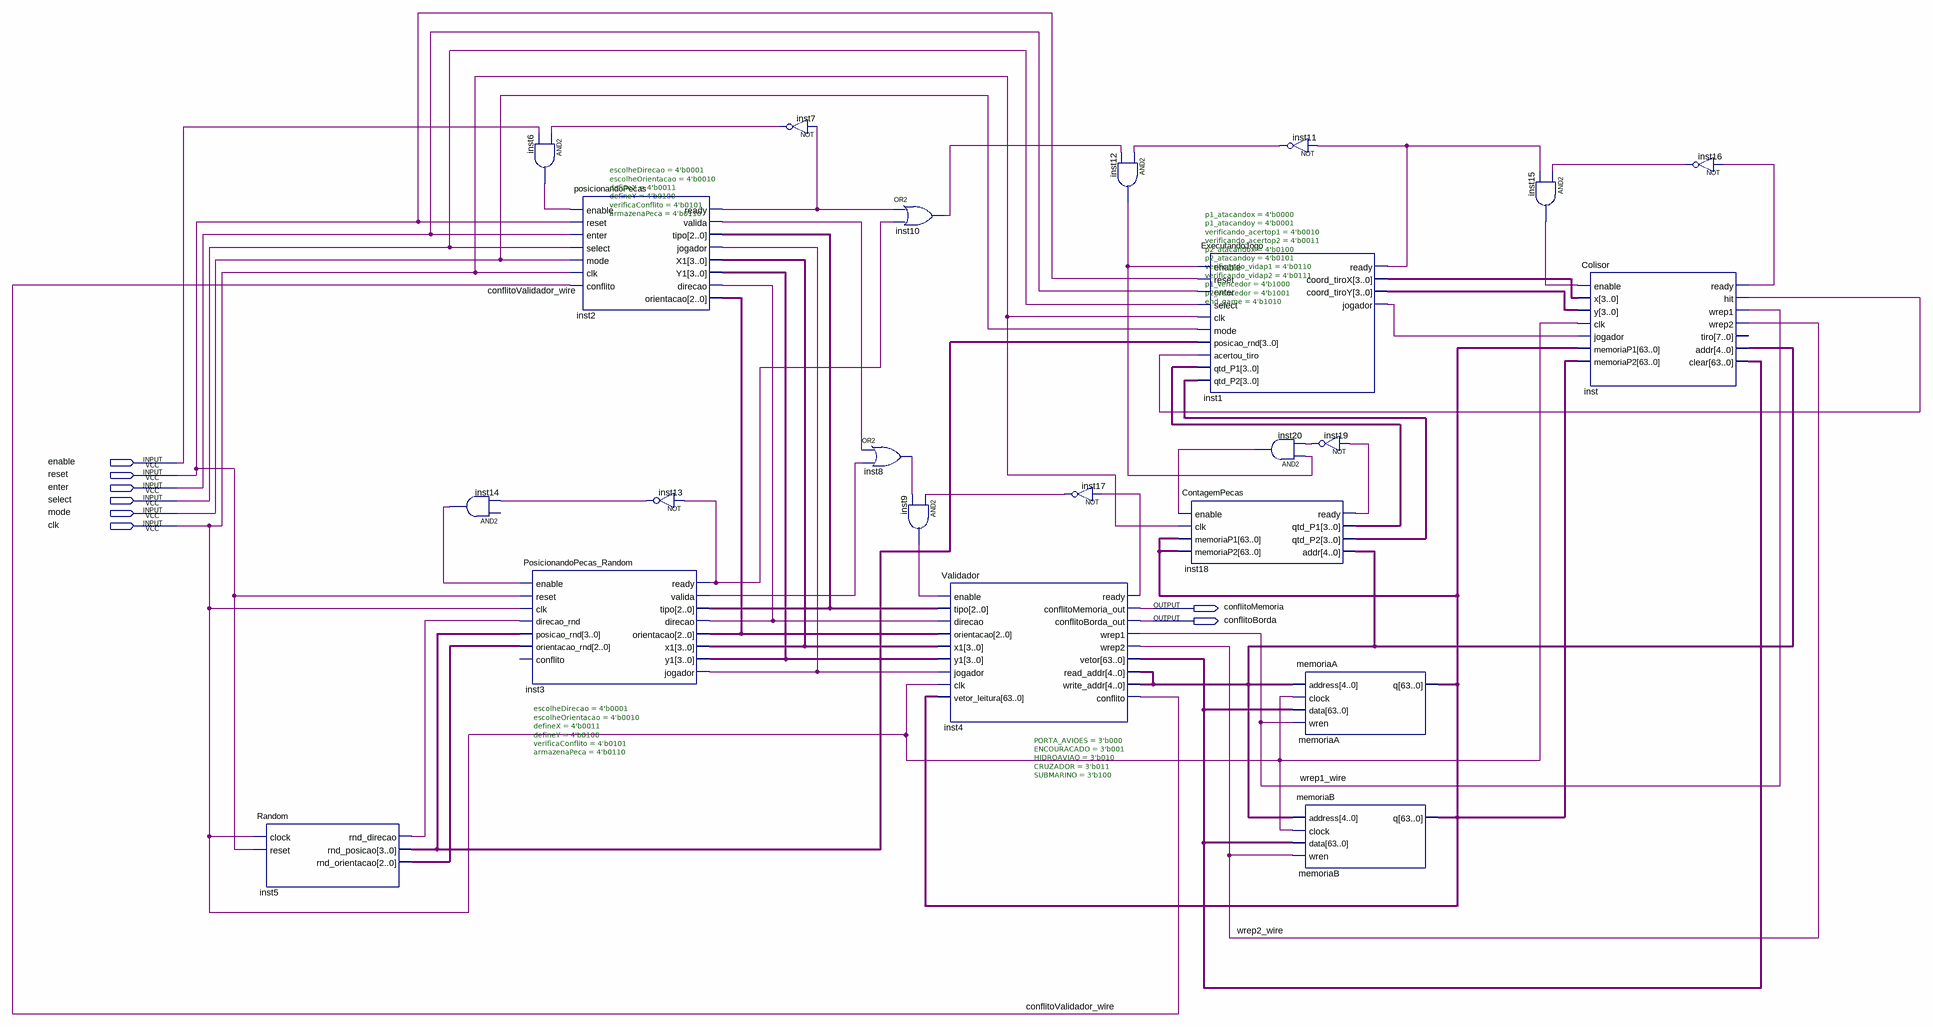
[diagram p0: schematic sheet]
// Quartus schematic BatalhaNavalDefinitivo.bdf as structural Verilog: 23 symbols, 8 pins
module BatalhaNavalDefinitivo (
  input  enable,
  input  reset,
  input  enter,
  input  select,
  input  mode,
  input  clk,
  output conflitoMemoria,
  output conflitoBorda
);

  wire conflitoValidador_wire, inst1_jogador, inst1_ready, inst2_ready, inst2_valida, inst3_direcao,
       inst3_jogador, inst3_ready, inst3_valida, inst4_ready, inst5_rnd_direcao, inst6_out, inst7_out,
       inst8_out, inst9_out, inst10_out, inst11_out, inst12_out, inst13_out, inst14_out, inst15_out,
       inst16_out, inst17_out, inst18_ready, inst19_out, inst20_out, inst_hit, inst_ready, wrep1_wire,
       wrep2_wire;
  wire [2:0] inst3_orientacao, inst3_tipo, inst5_rnd_orientacao;
  wire [3:0] inst1_coord_tirox, inst1_coord_tiroy, inst3_x1, inst3_y1, inst5_rnd_posicao, inst18_qtd_p1,
       inst18_qtd_p2;
  wire [4:0] inst4_read_addr;
  wire [63:0] inst4_vetor, memoriaA_q;

  Random inst5 (
    .clock(clk), .reset(reset), .rnd_direcao(inst5_rnd_direcao), .rnd_posicao(inst5_rnd_posicao),
    .rnd_orientacao(inst5_rnd_orientacao));
  buf inst14 (inst14_out, inst13_out);  // AND2 open: IN1
  and inst6 (inst6_out, inst7_out, enable);
  PosicionandoPecas_Random #(.escolheDirecao(4'b0001), .escolheOrientacao(4'b0010), .defineX(4'b0011), .defineY(4'b0100), .verificaConflito(4'b0101), .armazenaPeca(4'b0110)) inst3 (
    .enable(inst14_out), .reset(reset), .clk(clk), .direcao_rnd(inst5_rnd_direcao),
    .posicao_rnd(inst5_rnd_posicao), .orientacao_rnd(inst5_rnd_orientacao), .ready(inst3_ready),
    .valida(inst3_valida), .tipo(inst3_tipo), .direcao(inst3_direcao), .orientacao(inst3_orientacao),
    .x1(inst3_x1), .y1(inst3_y1), .jogador(inst3_jogador));  // open: conflito
  posicionandoPecas #(.escolheDirecao(4'b0001), .escolheOrientacao(4'b0010), .defineX(4'b0011), .defineY(4'b0100), .verificaConflito(4'b0101), .armazenaPeca(4'b0110)) inst2 (
    .enable(inst6_out), .reset(reset), .enter(enter), .select(select), .mode(mode), .clk(clk),
    .conflito(conflitoValidador_wire), .ready(inst2_ready), .valida(inst2_valida), .tipo(inst3_tipo),
    .jogador(inst3_jogador), .X1(inst3_x1), .Y1(inst3_y1), .direcao(inst3_direcao),
    .orientacao(inst3_orientacao));
  not inst13 (inst13_out, inst3_ready);
  not inst7 (inst7_out, inst2_ready);
  or inst8 (inst8_out, inst2_valida, inst3_valida);
  or inst10 (inst10_out, inst2_ready, inst3_ready);
  and inst9 (inst9_out, inst17_out, inst8_out);
  Validador #(.PORTA_AVIOES(3'b000), .ENCOURACADO(3'b001), .HIDROAVIAO(3'b010), .CRUZADOR(3'b011), .SUBMARINO(3'b100)) inst4 (
    .enable(inst9_out), .tipo(inst3_tipo), .direcao(inst3_direcao), .orientacao(inst3_orientacao),
    .x1(inst3_x1), .y1(inst3_y1), .jogador(inst3_jogador), .clk(clk), .vetor_leitura(memoriaA_q),
    .ready(inst4_ready), .conflitoMemoria_out(conflitoMemoria), .conflitoBorda_out(conflitoBorda),
    .wrep1(wrep1_wire), .wrep2(wrep2_wire), .vetor(inst4_vetor), .read_addr(inst4_read_addr),
    .write_addr(inst4_read_addr), .conflito(conflitoValidador_wire));
  not inst17 (inst17_out, inst4_ready);
  and inst12 (inst12_out, inst11_out, inst10_out);
  ContagemPecas inst18 (
    .enable(inst20_out), .clk(clk), .memoriaP1(memoriaA_q), .memoriaP2(memoriaA_q), .ready(inst18_ready),
    .qtd_P1(inst18_qtd_p1), .qtd_P2(inst18_qtd_p2), .addr(inst4_read_addr));
  ExecutandoJogo #(.p1_atacandox(4'b0000), .p1_atacandoy(4'b0001), .verificando_acertop1(4'b0010), .verificando_acertop2(4'b0011), .p2_atacandox(4'b0100), .p2_atacandoy(4'b0101), .verificando_vidap1(4'b0110), .verificando_vidap2(4'b0111), .p1_vencedor(4'b1000), .p2_vencedor(4'b1001), .end_game(4'b1010)) inst1 (
    .enable(inst12_out), .reset(reset), .enter(enter), .select(select), .clk(clk), .mode(mode),
    .posicao_rnd(inst5_rnd_posicao), .acertou_tiro(inst_hit), .qtd_P1(inst18_qtd_p1), .qtd_P2(inst18_qtd_p2),
    .ready(inst1_ready), .coord_tiroX(inst1_coord_tirox), .coord_tiroY(inst1_coord_tiroy),
    .jogador(inst1_jogador));
  not inst11 (inst11_out, inst1_ready);
  and inst20 (inst20_out, inst12_out, inst19_out);
  not inst19 (inst19_out, inst18_ready);
  memoriaA memoriaA (.address(inst4_read_addr), .clock(clk), .data(inst4_vetor), .wren(wrep1_wire), .q(memoriaA_q));
  memoriaB memoriaB (.address(inst4_read_addr), .clock(clk), .data(inst4_vetor), .wren(wrep2_wire), .q(memoriaA_q));
  and inst15 (inst15_out, inst16_out, inst1_ready);
  Colisor inst (
    .enable(inst15_out), .x(inst1_coord_tirox), .y(inst1_coord_tiroy), .clk(clk), .jogador(inst1_jogador),
    .memoriaP1(memoriaA_q), .memoriaP2(memoriaA_q), .ready(inst_ready), .hit(inst_hit), .wrep1(wrep1_wire),
    .wrep2(wrep2_wire), .addr(inst4_read_addr), .clear(inst4_vetor));  // open: tiro
  not inst16 (inst16_out, inst_ready);
endmodule
